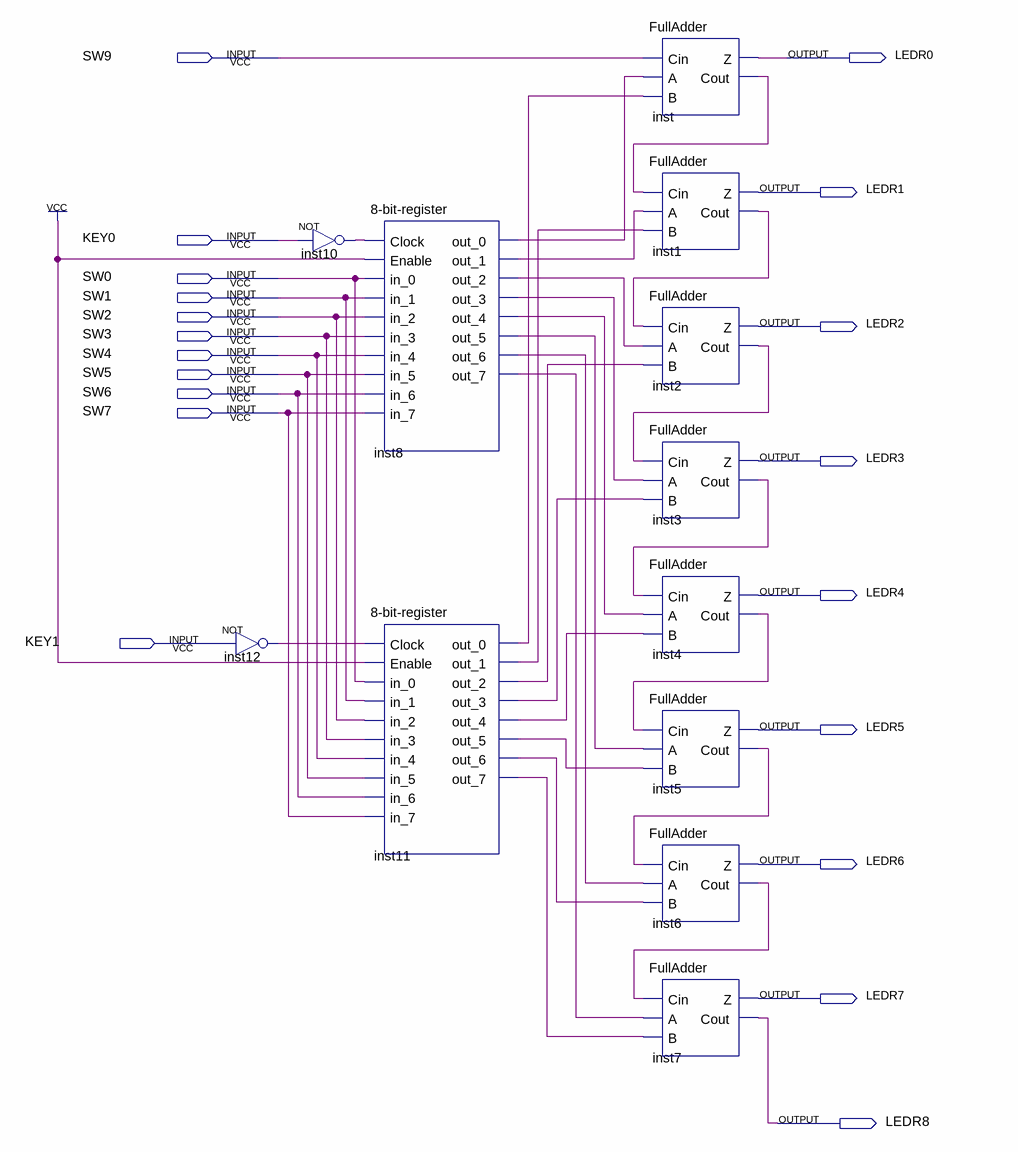
[diagram p0: schematic sheet]
// Quartus schematic Testbench.bdf as structural Verilog: 12 symbols, 20 pins
module Testbench (
  input  SW9,
  input  KEY0,
  input  SW0,
  input  SW1,
  input  SW2,
  input  SW3,
  input  SW4,
  input  SW5,
  input  SW6,
  input  SW7,
  input  KEY1,
  output LEDR0,
  output LEDR1,
  output LEDR2,
  output LEDR3,
  output LEDR4,
  output LEDR5,
  output LEDR6,
  output LEDR7,
  output LEDR8
);

  wire inst1_cout, inst2_cout, inst3_cout, inst4_cout, inst5_cout, inst6_cout, inst8_out_0, inst8_out_1,
       inst8_out_2, inst8_out_3, inst8_out_4, inst8_out_5, inst8_out_6, inst8_out_7, inst10_out,
       inst11_out_0, inst11_out_1, inst11_out_2, inst11_out_3, inst11_out_4, inst11_out_5, inst11_out_6,
       inst11_out_7, inst12_out, inst_cout;

  not inst12 (inst12_out, KEY1);
  not inst10 (inst10_out, KEY0);
  \8-bit-register  inst8 (
    .Clock(inst10_out), .Enable(1'b1), .in_0(SW0), .in_1(SW1), .in_2(SW2), .in_3(SW3), .in_4(SW4),
    .in_5(SW5), .in_6(SW6), .in_7(SW7), .out_0(inst8_out_0), .out_1(inst8_out_1), .out_2(inst8_out_2),
    .out_3(inst8_out_3), .out_4(inst8_out_4), .out_5(inst8_out_5), .out_6(inst8_out_6), .out_7(inst8_out_7));
  \8-bit-register  inst11 (
    .Clock(inst12_out), .Enable(1'b1), .in_0(SW0), .in_1(SW1), .in_2(SW2), .in_3(SW3), .in_4(SW4),
    .in_5(SW5), .in_6(SW6), .in_7(SW7), .out_0(inst11_out_0), .out_1(inst11_out_1), .out_2(inst11_out_2),
    .out_3(inst11_out_3), .out_4(inst11_out_4), .out_5(inst11_out_5), .out_6(inst11_out_6),
    .out_7(inst11_out_7));
  FullAdder inst (.Cin(SW9), .A(inst8_out_0), .B(inst11_out_0), .Z(LEDR0), .Cout(inst_cout));
  FullAdder inst1 (.Cin(inst_cout), .A(inst8_out_1), .B(inst11_out_1), .Z(LEDR1), .Cout(inst1_cout));
  FullAdder inst2 (.Cin(inst1_cout), .A(inst8_out_2), .B(inst11_out_2), .Z(LEDR2), .Cout(inst2_cout));
  FullAdder inst3 (.Cin(inst2_cout), .A(inst8_out_3), .B(inst11_out_3), .Z(LEDR3), .Cout(inst3_cout));
  FullAdder inst4 (.Cin(inst3_cout), .A(inst8_out_4), .B(inst11_out_4), .Z(LEDR4), .Cout(inst4_cout));
  FullAdder inst5 (.Cin(inst4_cout), .A(inst8_out_5), .B(inst11_out_5), .Z(LEDR5), .Cout(inst5_cout));
  FullAdder inst6 (.Cin(inst5_cout), .A(inst8_out_6), .B(inst11_out_6), .Z(LEDR6), .Cout(inst6_cout));
  FullAdder inst7 (.Cin(inst6_cout), .A(inst8_out_7), .B(inst11_out_7), .Z(LEDR7), .Cout(LEDR8));
endmodule
